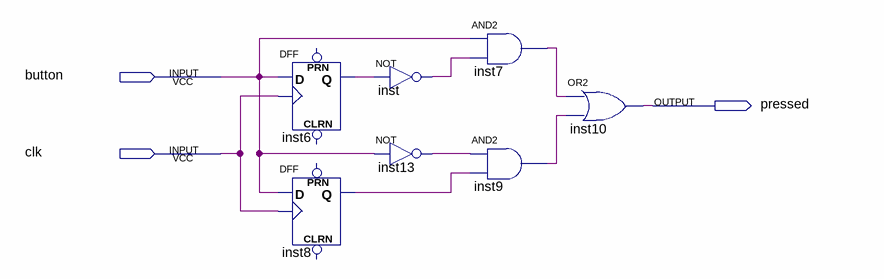
[diagram p0: schematic sheet]
// Quartus schematic buttonPressIndicatorFront.bdf as structural Verilog: 7 symbols, 3 pins
module buttonPressIndicatorFront (
  input  button,
  input  clk,
  output pressed
);

  wire inst6_q, inst7_out, inst8_q, inst9_out, inst13_out, inst_out;

  DFF inst6 (.CLK(clk), .D(button), .Q(inst6_q));  // open: CLRN, PRN
  DFF inst8 (.CLK(clk), .D(button), .Q(inst8_q));  // open: CLRN, PRN
  not inst (inst_out, inst6_q);
  not inst13 (inst13_out, button);
  and inst7 (inst7_out, button, inst_out);
  and inst9 (inst9_out, inst13_out, inst8_q);
  or inst10 (pressed, inst7_out, inst9_out);
endmodule
